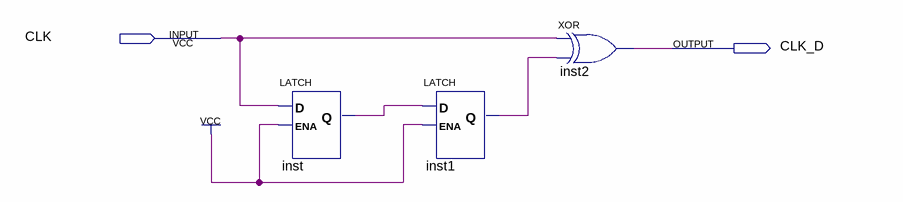
[diagram p0: schematic sheet]
// Quartus schematic clk_doubler.bdf as structural Verilog: 3 symbols, 2 pins
module clk_doubler (
  input  CLK,
  output CLK_D
);

  wire inst1_q, inst_q;

  LATCH inst (.D(CLK), .ENA(1'b1), .Q(inst_q));
  LATCH inst1 (.D(inst_q), .ENA(1'b1), .Q(inst1_q));
  xor inst2 (CLK_D, CLK, inst1_q);
endmodule
